# EAGLE schematic weblight_developer (EAGLE 7.4.0)
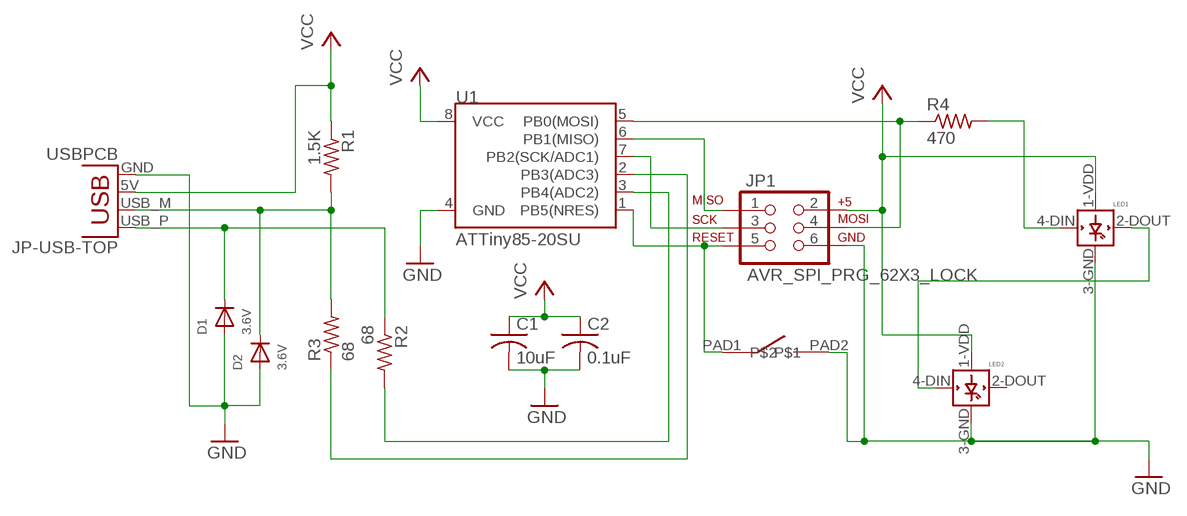
[diagram p0: schematic, sheet 1]

## Parts
C1  10uF  C-USC0805  [C0805]
C2  0.1uF  C-USC0805  [C0805]
D1  3.6V  DIODESOD-323  [SOD-323]
D2  3.6V  DIODESOD-323  [SOD-323]
JP1  AVR_SPI_PRG_62X3_LOCK  [2X3_LOCK]
JP-USB-TOP  USBPCB  [USB-A-PCB]
LED1  WS2812B  [WS2812B]
LED2  WS2812B  [WS2812B]
R1  1.5K  R-US_R0805  [R0805]
R2  68  R-US_R0805  [R0805]
R3  68  R-US_R0805  [R0805]
R4  470  R-US_R0805  [R0805]
SW_RESET  BUTTON_TD-85XU  [BUTTON_TD-85XU]
U1  ATTiny85-20SU  ATTINY45TINY85-20-SMT  [SO08-EIAJ]

## Nets
DIN_1: LED1.4-DIN(DIN) R4.2
DIN_2: LED1.2-DOUT(DOUT) LED2.4-DIN(DIN)
GND: C1.2 C2.2 D1.A D2.A JP1.6 JP-USB-TOP.GND LED1.3-GND(GND) LED2.3-GND(GND) SW_RESET.PAD2 U1.4(GND)
MISO: JP1.1 U1.6(PB1(MISO))
MOSI/DIN_RAW: JP1.4 R4.1 U1.5(PB0(MOSI))
N$4: JP1.3 U1.7(PB2(SCK/ADC1))
RESET: JP1.5 SW_RESET.PAD1 U1.1(PB5(NRES))
USB_D_MINUS: R3.1 U1.2(PB3(ADC3))
USB_D_MINUS_RAW: D2.C JP-USB-TOP.USB_M(D-) R1.2 R3.2
USB_D_PLUS: R2.2 U1.3(PB4(ADC2))
USB_D_PLUS_RAW: D1.C JP-USB-TOP.USB_P(D+) R2.1
VCC: C1.1 C2.1 JP1.2 JP-USB-TOP.5V(VBUS) LED1.1-VDD(VDD) LED2.1-VDD(VDD) R1.1 U1.8(VCC)
Unconnected: LED2.2-DOUT(DOUT)

## Library data of the parts
C1 C2 = rcl:C-US: CAPACITOR, American symbol
D1 D2 = microbuilder:DIODE: Diode SMA Model Volts Amps Type Vf Vr Digikey # Notes SSA34-E3 40V 3A Schottky 480mV @ 3A 200uA @ 40V SSA34-E3/61TGITR-ND CDBA120-G 20V 1A Schottky 500mV @ 1A 500uA @ 20V 641-1014-6-ND REEL MBRA210 10V 2A Schottky 350mV @ 2A 700uA @ 10V MBRA210LT3 SOD-123 Model Volts Amps Type Vf Vr Order # Notes BAT54T1G 30V 200mA Schottky 800mV @ 200mA 2uA @ 25V BAT54T1GOSTR-ND B0530W 30V 500mA Schottky 430mV @ 500mA 130uA @ 30V B0530W-FDICT-ND REEL MBR120 1A 20V Schottky 340mV @ 1A MBR120VLSFT1GOSCT-ND SOD-323 Model Volts Amps Type Vf Vr Order # Notes PMEG2005EJ 20V 500mA Schottky 355mV @ 500mA 568-4110-1-ND ZLLS410 10V 570mA Schottky 380mV @ 570mA ZLLS410CT-ND 1N4148WS 75V 150mA Silicon/Simple 1V 1N4148WSFSCT-ND REEL SOD-523 Model Volts Amps Type Vf Vr Order # Notes BAT54XV2 30V 200mA Schottky 0.8V @ 100mA BAT54XV2CT-ND TB751S 30V 30mA Schottky RB751S-40TE61CT-ND SOT23-R/W (R = Solder Paste/Reflow Ovens, W = Hand-Soldering) Model Volts Amps Type Vf Vr Order # Notes BAT54FILM 40V 300mA Schottky 497-7162-1-ND
JP1 = SparkFun-Connectors:AVR_SPI_PRG_6: AVR ISP 6 Pin This is the reduced ISP connector for AVR programming. Common on Arduino. This footprint will take up less PCB space and can be used with a 10-pin to 6-pin adapter such as SKU: BOB-08508 **Special note about "TEST_POINT" package. The stop mask is on the top side, so if you want your programming test points to be on the bottom of your board, make sure to place this package on the bottom side of the board. This also ensure that the orientation to program from the bottom side will be correct.
JP-USB-TOP = SparkFun-Connectors:USB: USB Connectors USB-B-PTH is fully proven SKU : PRT-00139/CONN-08278 USB-miniB is fully proven SKU : PRT-00587 USB-A-PCB is untested. USB-A-H is throughly reviewed, but untested. Spark Fun Electronics SKU : PRT-00437 USB-B-SMT is throughly reviewed, but untested. Needs silkscreen touching up. USB-A-S has not been used/tested USB-MB-H has not been used/tested USB-MICROB has been used. CONN-09505
LED1 LED2 = weblight:WS2812B
R1-R4 = rcl:R-US_: RESISTOR, American symbol
SW_RESET = weblight:BUTTON_TD-85XU
U1 = SparkFun-DigitalIC:ATTINY45: Atmel 8-pin 2/4/8kB flash uC; PROD_ID: IC-09092; VALUE: Tiny85-20-SMT